# EAGLE schematic Laptimer (EAGLE 6.3)
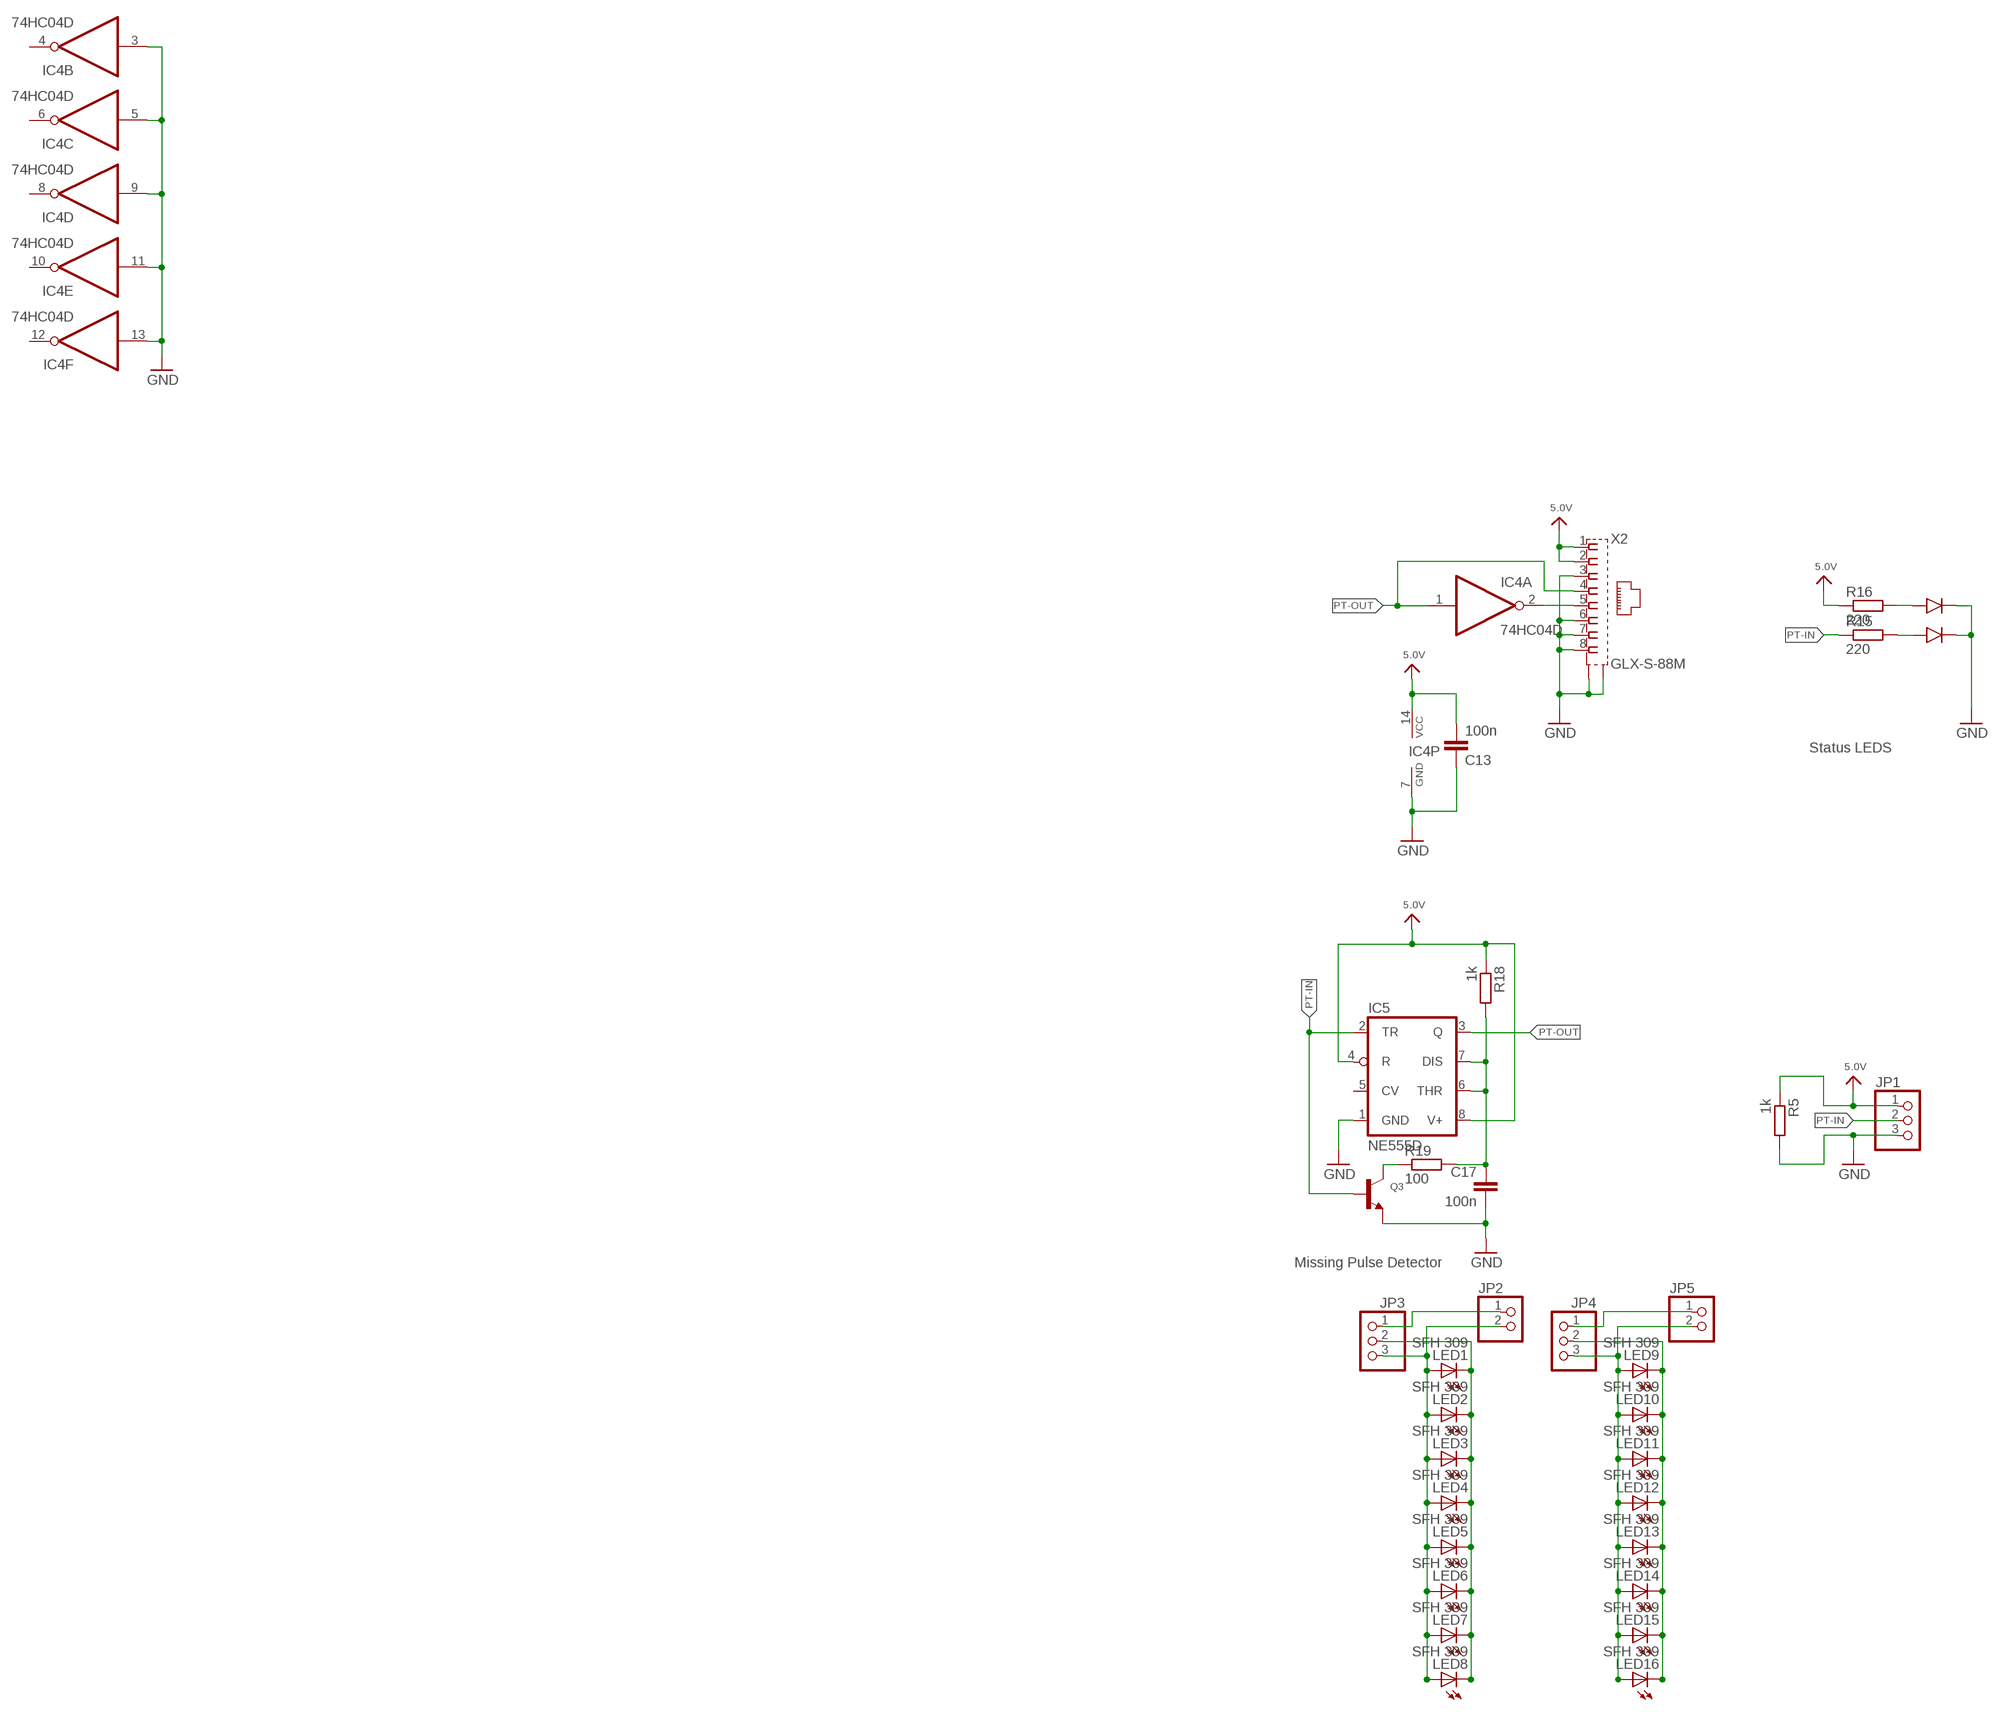
[diagram p0: schematic, sheet 1]

## Parts
C13  100n  C-EUC0603K  [C0603K]
C17  100n  C-EUC0603K  [C0603K]
IC4  74HC04D  [SO14]
IC5  NE555D  [SO08]
JP1  PINHD-1X3  [1X03]
JP2  HEADER-1X2ROUND  [1X02_ROUND]
JP3  PINHD-1X3  [1X03]
JP4  PINHD-1X3  [1X03]
JP5  HEADER-1X2ROUND  [1X02_ROUND]
LED1  SFH 309  LED3MM  [LED3MM]
LED2  SFH 309  LED3MM  [LED3MM]
LED3  SFH 309  LED3MM  [LED3MM]
LED4  SFH 309  LED3MM  [LED3MM]
LED5  SFH 309  LED3MM  [LED3MM]
LED6  SFH 309  LED3MM  [LED3MM]
LED7  SFH 309  LED3MM  [LED3MM]
LED8  SFH 309  LED3MM  [LED3MM]
LED9  SFH 309  LED3MM  [LED3MM]
LED10  SFH 309  LED3MM  [LED3MM]
LED11  SFH 309  LED3MM  [LED3MM]
LED12  SFH 309  LED3MM  [LED3MM]
LED13  SFH 309  LED3MM  [LED3MM]
LED14  SFH 309  LED3MM  [LED3MM]
LED15  SFH 309  LED3MM  [LED3MM]
LED16  SFH 309  LED3MM  [LED3MM]
Q3  TRANSISTOR_NPNWIDE  [SOT23-WIDE]
R5  1k  R-EU_R0603  [R0603]
R15  220  R-EU_R0603  [R0603]
R16  220  R-EU_R0603  [R0603]
R18  1k  R-EU_R0603  [R0603]
R19  100  R-EU_R0603  [R0603]
U$19  BI-LEVEL-LED-INDICATOR  [BI-LEVEL-LED-INDICATOR]
X2  GLX-S-88M  [GLX-S-88M]

## Nets
5.0V: C13.2 IC4.14(P:VCC) IC5.4(R) IC5.8(V+) JP1.1 R5.1 R16.1 R18.1 X2.1 X2.2
GND: C13.1 C17.2 IC4.3(B:I) IC4.5(C:I) IC4.7(P:GND) IC4.9(D:I) IC4.11(E:I) IC4.13(F:I) IC5.1(GND) JP1.3 Q3.2(E) R5.2 U$19.CATHODE1 U$19.CATHODE2 X2.3 X2.6 X2.7 X2.8 X2.S1 X2.S2
INT: JP3.2 LED1.K(C) LED2.K(C) LED3.K(C) LED4.K(C) LED5.K(C) LED6.K(C) LED7.K(C) LED8.K(C)
INT1: JP4.2 LED9.K(C) LED10.K(C) LED11.K(C) LED12.K(C) LED13.K(C) LED14.K(C) LED15.K(C) LED16.K(C)
N$7: JP4.1 JP5.1
N$8: JP4.3 JP5.2 LED9.A LED10.A LED11.A LED12.A LED13.A LED14.A LED15.A LED16.A
N$10: JP2.1 JP3.1
N$22: IC4.2(A:O) X2.5
N$25: R15.2 U$19.ANODE1
N$32: R16.2 U$19.ANODE2
N$36: C17.1 IC5.6(THR) IC5.7(DIS) R18.2 R19.2
N$40: JP2.2 JP3.3 LED1.A LED2.A LED3.A LED4.A LED5.A LED6.A LED7.A LED8.A
N$41: Q3.3(C) R19.1
PT-IN: IC5.2(TR) JP1.2 Q3.1(B) R15.1
PT-OUT: IC4.1(A:I) IC5.3(Q) X2.4
Unconnected: IC4.4(B:O) IC4.6(C:O) IC4.8(D:O) IC4.10(E:O) IC4.12(F:O) IC5.5(CV)

## Notes on the sheet
- Status LEDS
- Missing Pulse Detector

## Library data of the parts
C13 C17 = rcl:C-EU: CAPACITOR, European symbol
IC4 = 74xx-eu:74*04: Hex INVERTER
IC5 = linear:*555: TIMER
JP1 JP3 JP4 = adafruit:PINHD-1X3: PIN HEADER
JP2 JP5 = microbuilder:HEADER-1X2: PIN HEADER
LED1-LED16 = adafruit:LED: LED OSRAM: - CHIPLED LG R971, LG N971, LY N971, LG Q971, LY Q971, LO R971, LY R971 LH N974, LH R974 LS Q976, LO Q976, LY Q976 LO Q996 - Hyper CHIPLED LW Q18S LB Q993, LB Q99A, LB R99A - SideLED LS A670, LO A670, LY A670, LG A670, LP A670 LB A673, LV A673, LT A673, LW A673 LH A674 LY A675 LS A676, LA A676, LO A676, LY A676, LW A676 LS A679, LY A679, LG A679 - Hyper Micro SIDELED® LS Y876, LA Y876, LO Y876, LY Y876 LT Y87S - SmartLED LW L88C, LW L88S LB L89C, LB L89S, LG L890 LS L89K, LO L89K, LY L89K LS L896, LA L896, LO L896, LY L896 - TOPLED LS T670, LO T670, LY T670, LG T670, LP T670 LSG T670, LSP T670, LSY T670, LOP T670, LYG T670 LG T671, LOG T671, LSG T671 LB T673, LV T673, LT T673, LW T673 LH T674 LS T676, LA T676, LO T676, LY T676, LB T676, LH T676, LSB T676, LW T676 LB T67C, LV T67C, LT T67C, LS T67K, LO T67K, LY T67K, LW E67C LS E67B, LA E67B, LO E67B, LY E67B, LB E67C, LV E67C, LT E67C LW T67C LS T679, LY T679, LG T679 LS T770, LO T770, LY T770, LG T770, LP T770 LB T773, LV T773, LT T773, LW T773 LH T774 LS E675, LA E675, LY E675, LS T675 LS T776, LA T776, LO T776, LY T776, LB T776 LHGB T686 LT T68C, LB T68C - Hyper Mini TOPLED® LB M676 - Mini TOPLED Santana® LG M470 LS M47K, LO M47K, LY M47K Source: http://www.osram.convergy.de/
Q3 = microbuilder:TRANSISTOR_NPN: NPN Transistor Transistor (NPN) 500mA 45V - BC817 [Digikey: 568-1631-1-ND] Transistor (NPN) 500mA 45V - BC817,215 [Mouser: 771-BC817-T/R] SOT23-R - SOT23 footprint optimised for use with solder paste and reflow ovens. SOT23-W - SOT23 footprint optimised for hand-soldering (larger pads).
R5 R15 R16 R18 R19 = rcl:R-EU_: RESISTOR, European symbol
U$19 = unicorn_v2:BI-LEVEL-LED-INDICATOR
X2 = con-kycon:GLX-S-88M: Mod. Jack, Right Angle, 8 posiotion, 8 contatcs RJ45 Source: GLX-S-88M.pdf; OC_FARNELL: unknown; OC_NEWARK: unknown